# Altium project 2016_CARTE_PUISSANCE.PRJPCB
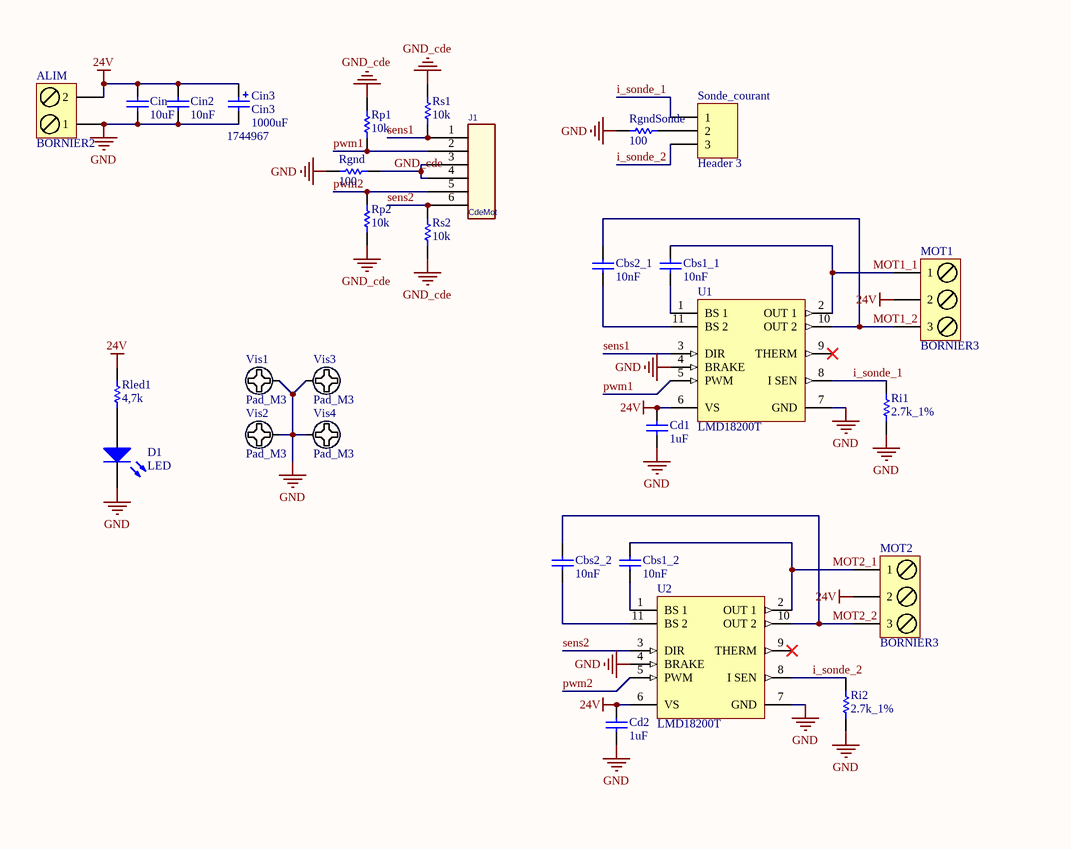
[diagram p0: 2016_CARTE_PUISSANCE.SchDoc, left]
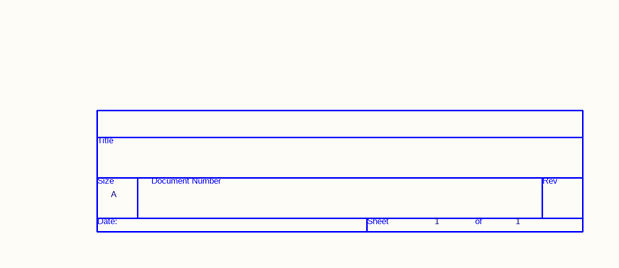
[diagram p1: 2016_CARTE_PUISSANCE.SchDoc, right]
1 sheet, 31 parts. Net scope: global (net labels, ports and power ports of the same name join across sheets).
Board file: 2016_CARTE_PUISSANCE.PCBDOC

## Sheet 2016_CARTE_PUISSANCE.SchDoc
size A4

### Parts
*  Page Count: 1  Page Size: A  (hidden comment: TitleBlock0)  (graphical)
ALIM  BORNIER2  [BORNIER2]
Cbs1_1  10nF  [C0805_N]
Cbs1_2  10nF  [C0805_N]
Cbs2_1  10nF  [C0805_N]
Cbs2_2  10nF  [C0805_N]
Cd1  1uF  [C1206_N]
Cd2  1uF  [C1206_N]
Cin  10uF  [C1206_N]
Cin2  10nF  [C0805_N]
Cin3  Cin3  value 1000uF  FAR: 1744967  [COND_POL_RAD_5.08B]
D1  LED  [LED_3mm]
J1  CdeMot  [RJ11_6/6]
MOT1  BORNIER3  [BORNIER3]
MOT2  BORNIER3  [BORNIER3]
Rgnd  100  [R1206_N]
RgndSonde  100  [R1206_N]
Ri1  2.7k_1%  [R1206_N]
Ri2  2.7k_1%  [R1206_N]
Rled1  4,7k  [R1206_N]
Rp1  10k  [R1206_N]
Rp2  10k  [R1206_N]
Rs1  10k  [R1206_N]
Rs2  10k  [R1206_N]
Sonde_courant  Header 3  [HDR1X3]
U1  LMD18200T  [TA11B]
U2  LMD18200T  [TA11B]
Vis1  Pad_M3  [M3x6mm]
Vis2  Pad_M3  [M3x6mm]
Vis3  Pad_M3  [M3x6mm]
Vis4  Pad_M3  [M3x6mm]

### Nets
24V: ALIM.2 Cd1.1 Cd2.1 Cin.2 Cin2.2 Cin3.1 MOT1.2 MOT2.2 Rled1.2 U1.6(VS) U2.6(VS)
GND: ALIM.1 Cd1.2 Cd2.2 Cin.1 Cin2.1 Cin3.2 D1.2 Rgnd.2 RgndSonde.2 Ri1.2 Ri2.2 U1.4(BRAKE) U1.7(GND) U2.4(BRAKE) U2.7(GND) Vis1.1 Vis2.1 Vis3.1 Vis4.1
GND_cde: J1.3 J1.4 Rgnd.1 Rp1.2 Rp2.1 Rs1.2 Rs2.1
i_sonde_1: Ri1.1 Sonde_courant.1 U1.8(I_SEN)
i_sonde_2: Ri2.1 Sonde_courant.3 U2.8(I_SEN)
MOT1_1: Cbs1_1.2 MOT1.1 U1.2(OUT_1)
MOT1_2: Cbs2_1.2 MOT1.3 U1.10(OUT_2)
MOT2_1: Cbs1_2.2 MOT2.1 U2.2(OUT_1)
MOT2_2: Cbs2_2.2 MOT2.3 U2.10(OUT_2)
pwm1: J1.2 Rp1.1 U1.5(PWM)
pwm2: J1.5 Rp2.2 U2.5(PWM)
sens1: J1.1 Rs1.1 U1.3(DIR)
sens2: J1.6 Rs2.2 U2.3(DIR)
NetCbs1_1_1: Cbs1_1.1 U1.1(BS_1)
NetCbs1_2_1: Cbs1_2.1 U2.1(BS_1)
NetCbs2_1_1: Cbs2_1.1 U1.11(BS_2)
NetCbs2_2_1: Cbs2_2.1 U2.11(BS_2)
NetD1_1: D1.1 Rled1.1
NetRgndSonde_1: RgndSonde.1 Sonde_courant.2

Not connected (* = marked no-connect by the designer): U1 9(THERM)*; U2 9(THERM)*

### Notes on the sheet
- (in symbol TitleBlock0) Title; Size; Document Number; Rev; Date:; Sheet; of

### Library data of the parts
ALIM = BORNIER2: Terminal blocks, 2 pins, pitch=5mm
Cbs1_1 Cbs1_2 Cbs2_1 Cbs2_2 Cd1 Cd2 Cin Cin2 = Capacitor: Published: 8-Jun-2000; LatestRevisionDate: 17-Jul-2002; LatestRevisionNote: Re-released for DXP Platform.; PackageReference: RAD-0.3; Publisher: Altium Limited
Cin3 = CONDENSATEUR_POLARISE: Polarized Capacitor; Published: 8-Jun-2000; LatestRevisionDate: 17-Jul-2002; LatestRevisionNote: Re-released for DXP Platform.; PackageReference: RB7.6-15; Publisher: Altium Limited
D1 = LED: Typical LED; Published: 8-Jun-2000; LatestRevisionDate: 08-Jul-2005; LatestRevisionNote: Mech Layer 1 removed.; PackageReference: LED-1; Publisher: Altium Limited
J1 = CONNECTEUR_RJ12
MOT1 MOT2 = BORNIER3: Terminal blocks, 2 pins, pitch=5mm
Rgnd RgndSonde Ri1 Ri2 Rled1 Rp1 Rp2 Rs1 Rs2 = Resistor: Published: 8-Jun-2000; LatestRevisionDate: 17-Jul-2002; LatestRevisionNote: Re-released for DXP Platform.; PackageReference: AXIAL-0.5; Publisher: Altium Limited
Sonde_courant = Header 3: Header, 3-Pin; LatestRevisionDate: 17-Jul-2002; LatestRevisionNote: Re-released for DXP Platform.; Publisher: Altium Limited
U1 U2 = LMD18200T: 3A, 55V H-Bridge; Manufacturer: National Semiconductor; CompType: MiscPower; PackageTopMarking: NSUZXYTTE#*LMD18200T*P+; PowerWise: N; FirstPublished: 4-Dec-2008; DatasheetVersion: Apr-2005; PackageVersion: revA, Mar-1987; PackageReference: TA11B; Publisher: Altium Limited; PackageDescription: TO-220, Molded, .788 x .421in Body, 11 Lead, .067in Pitch; PartNumber: LMD18200T; RoHS: O; PinCount: 11; DigiKeyPartNumber: LMD18200T-ND; ComponentLink1Description: LMD18200 Datasheet; ComponentLink1URL: http://www.national.com/ds/LM/LMD18200.pdf; ComponentLink2Description: LMD18200 Web Page; ComponentLink2URL: http://www.national.com/pf/LM/LMD18200.html; ComponentLink3Description: TA11B Package Page; ComponentLink3URL: http://www.national.com/packaging/folders/ta11b.html
Vis1-Vis4 = Vis M3 X 6mm _TORX_Tête 6mm: Publisher: Damien Guitton
* = TitleBlock0: Page Number: 1; Page Create Date: March  8, 1995